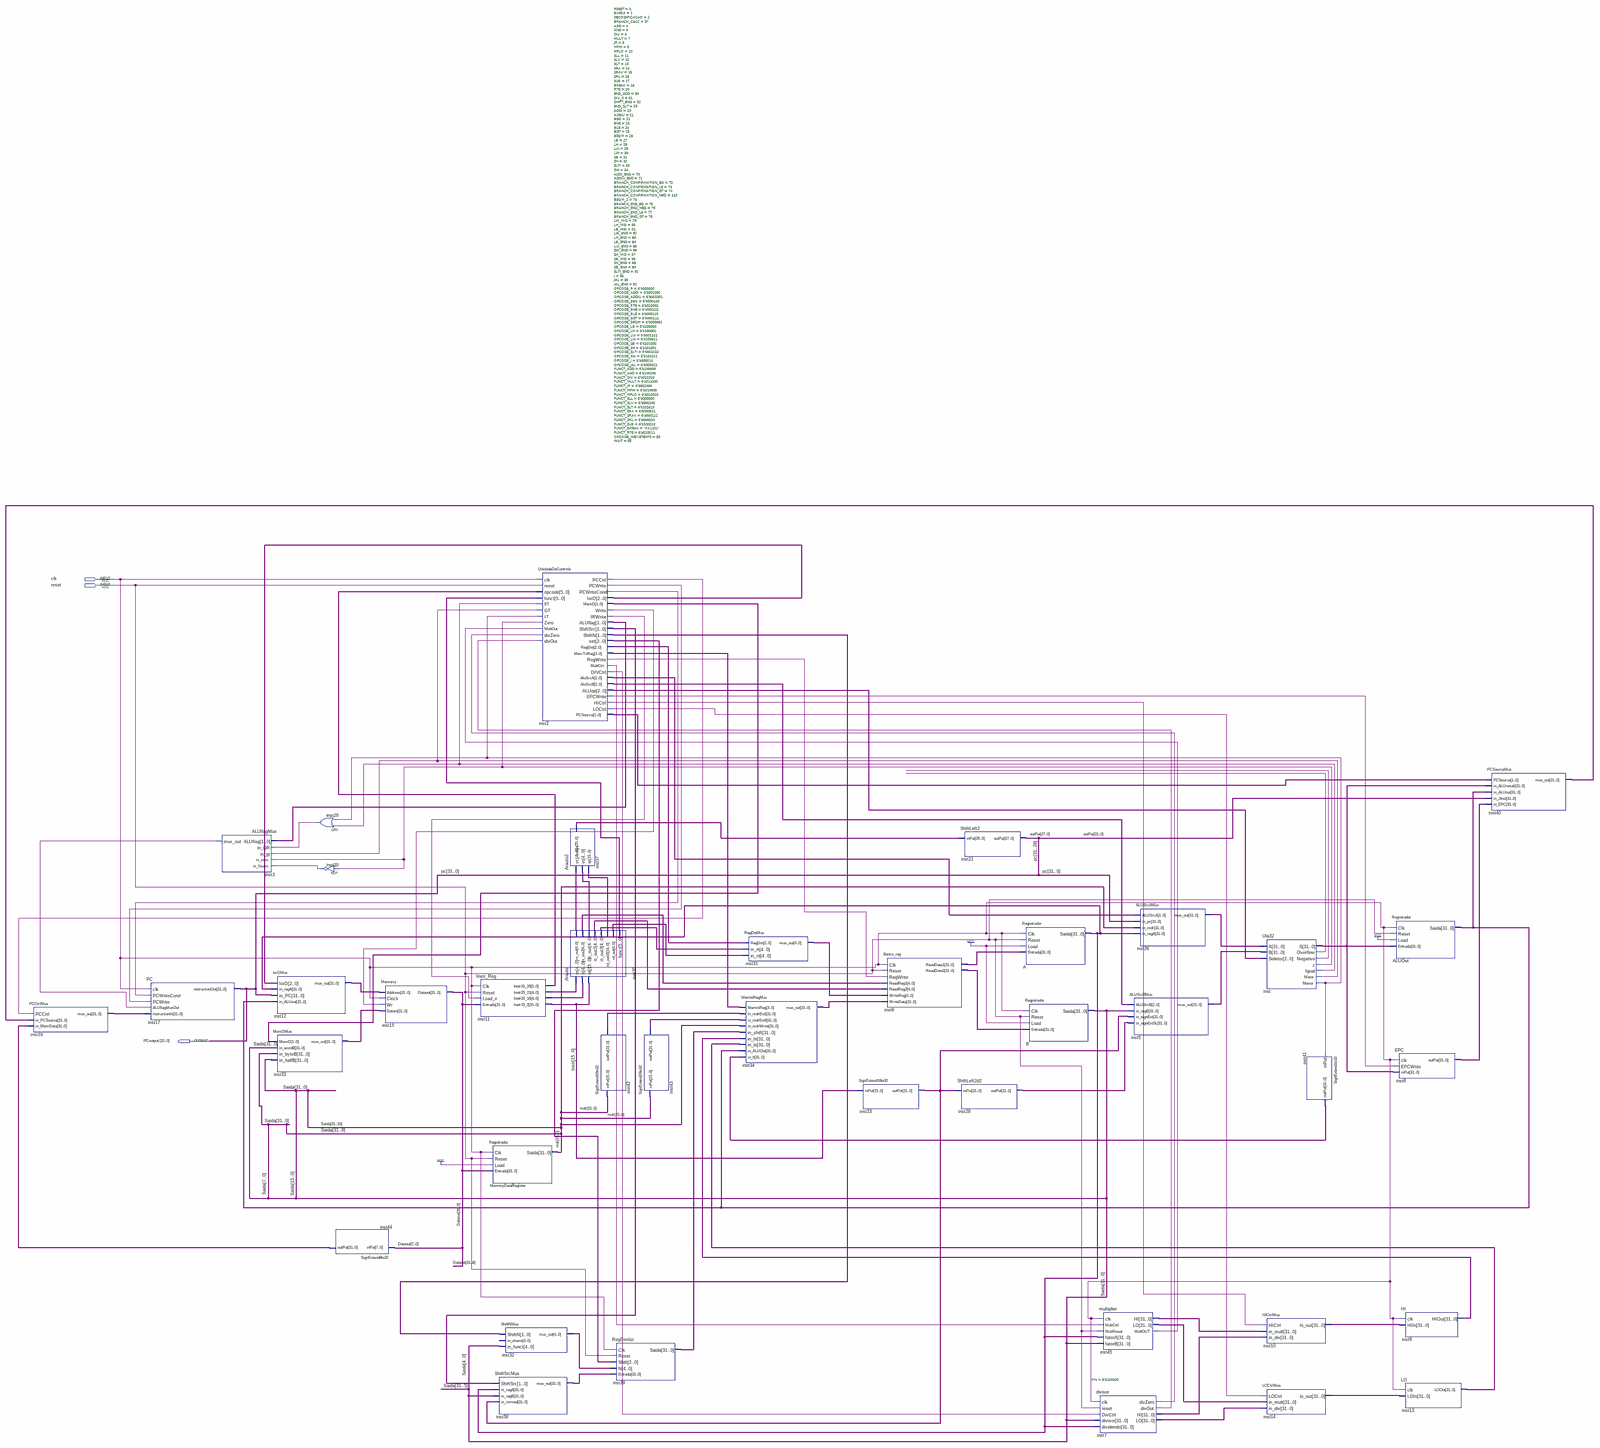
[diagram p0: schematic sheet, whole]
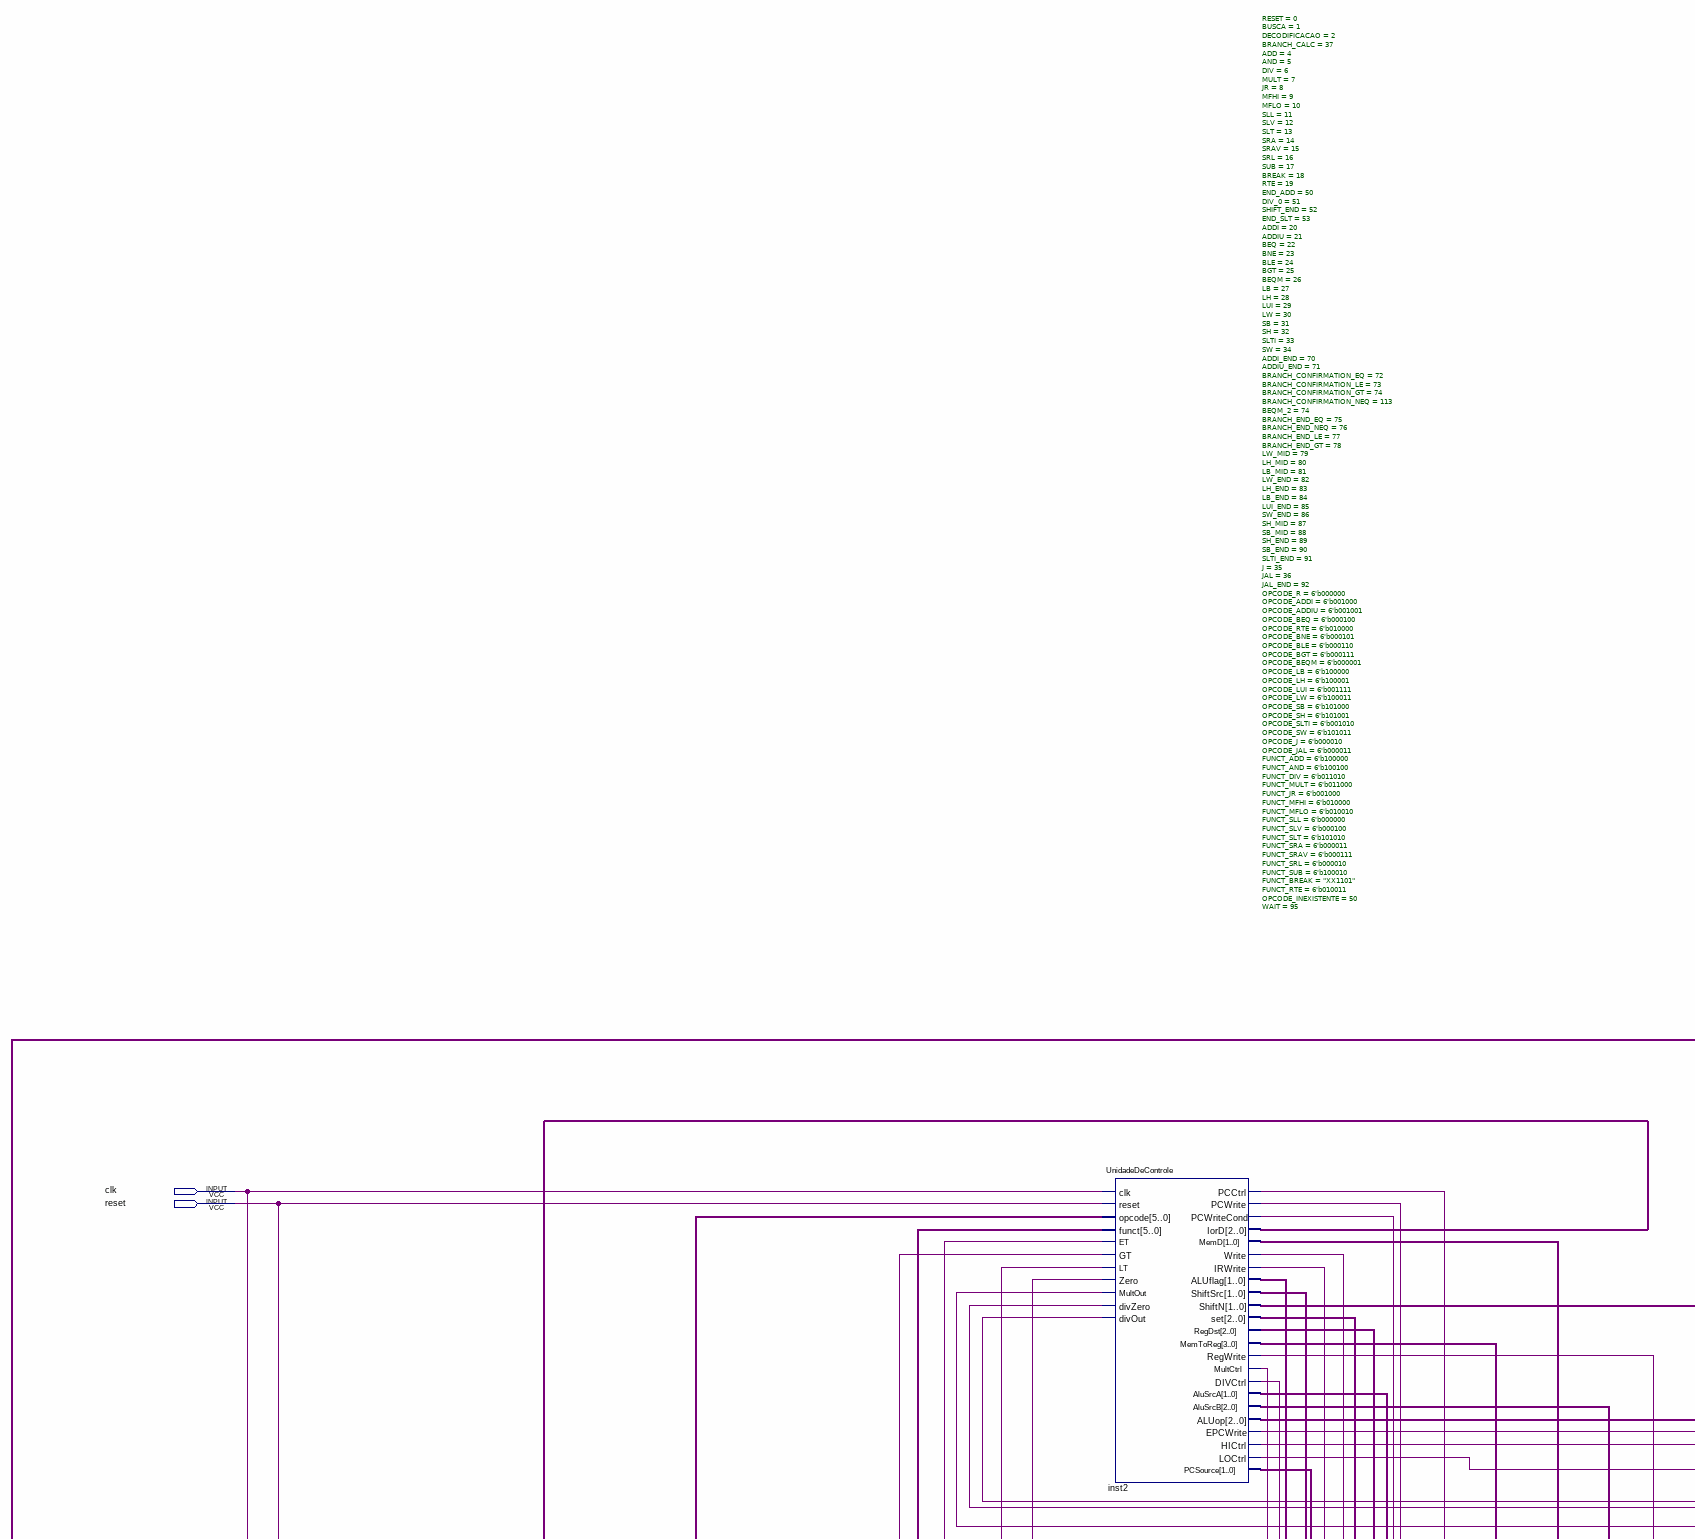
[diagram p1: schematic sheet, upper left part]
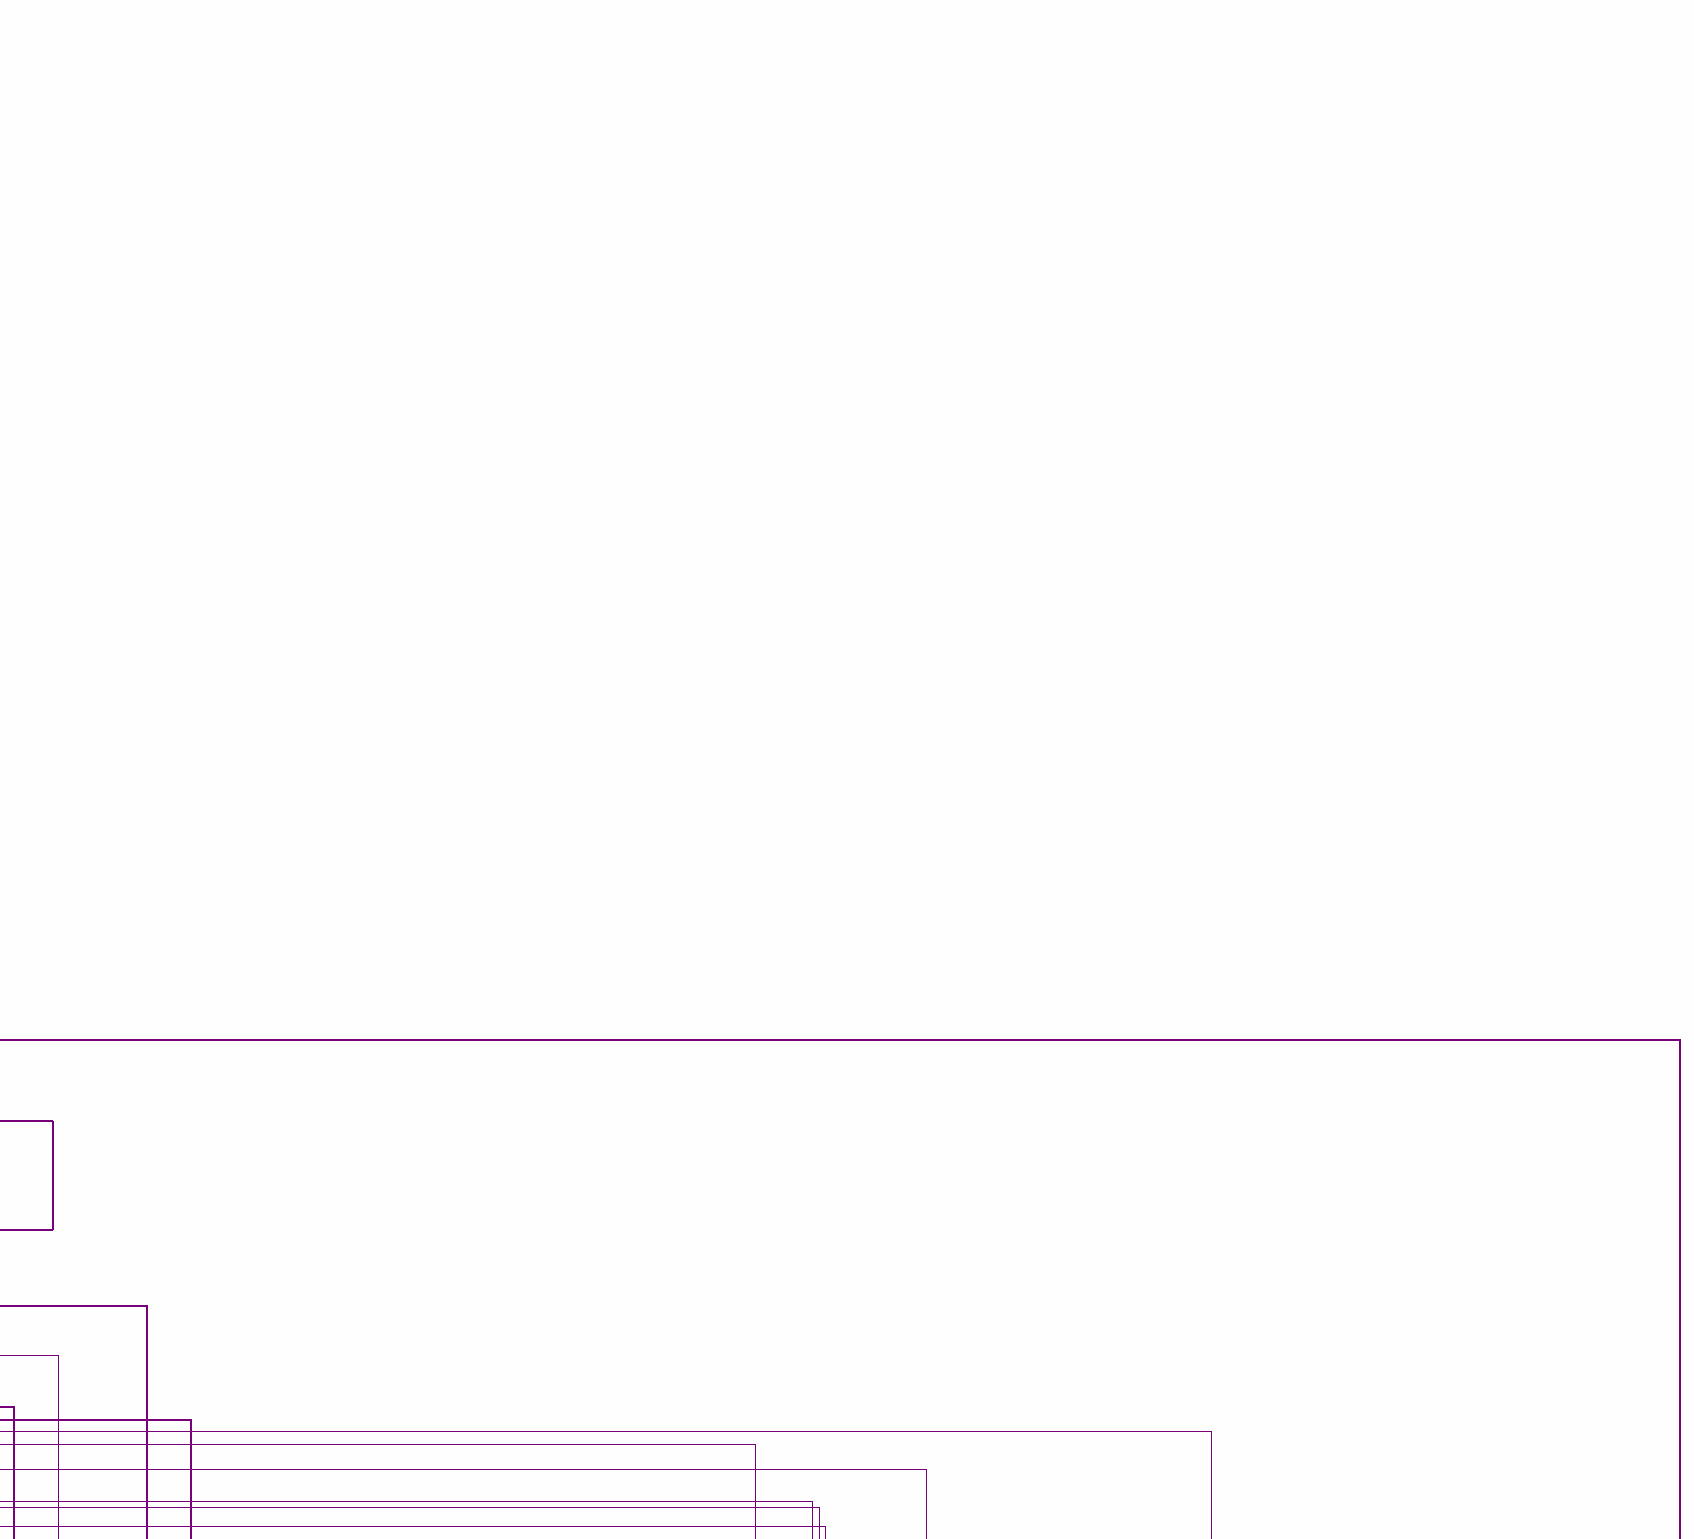
[diagram p2: schematic sheet, upper right part]
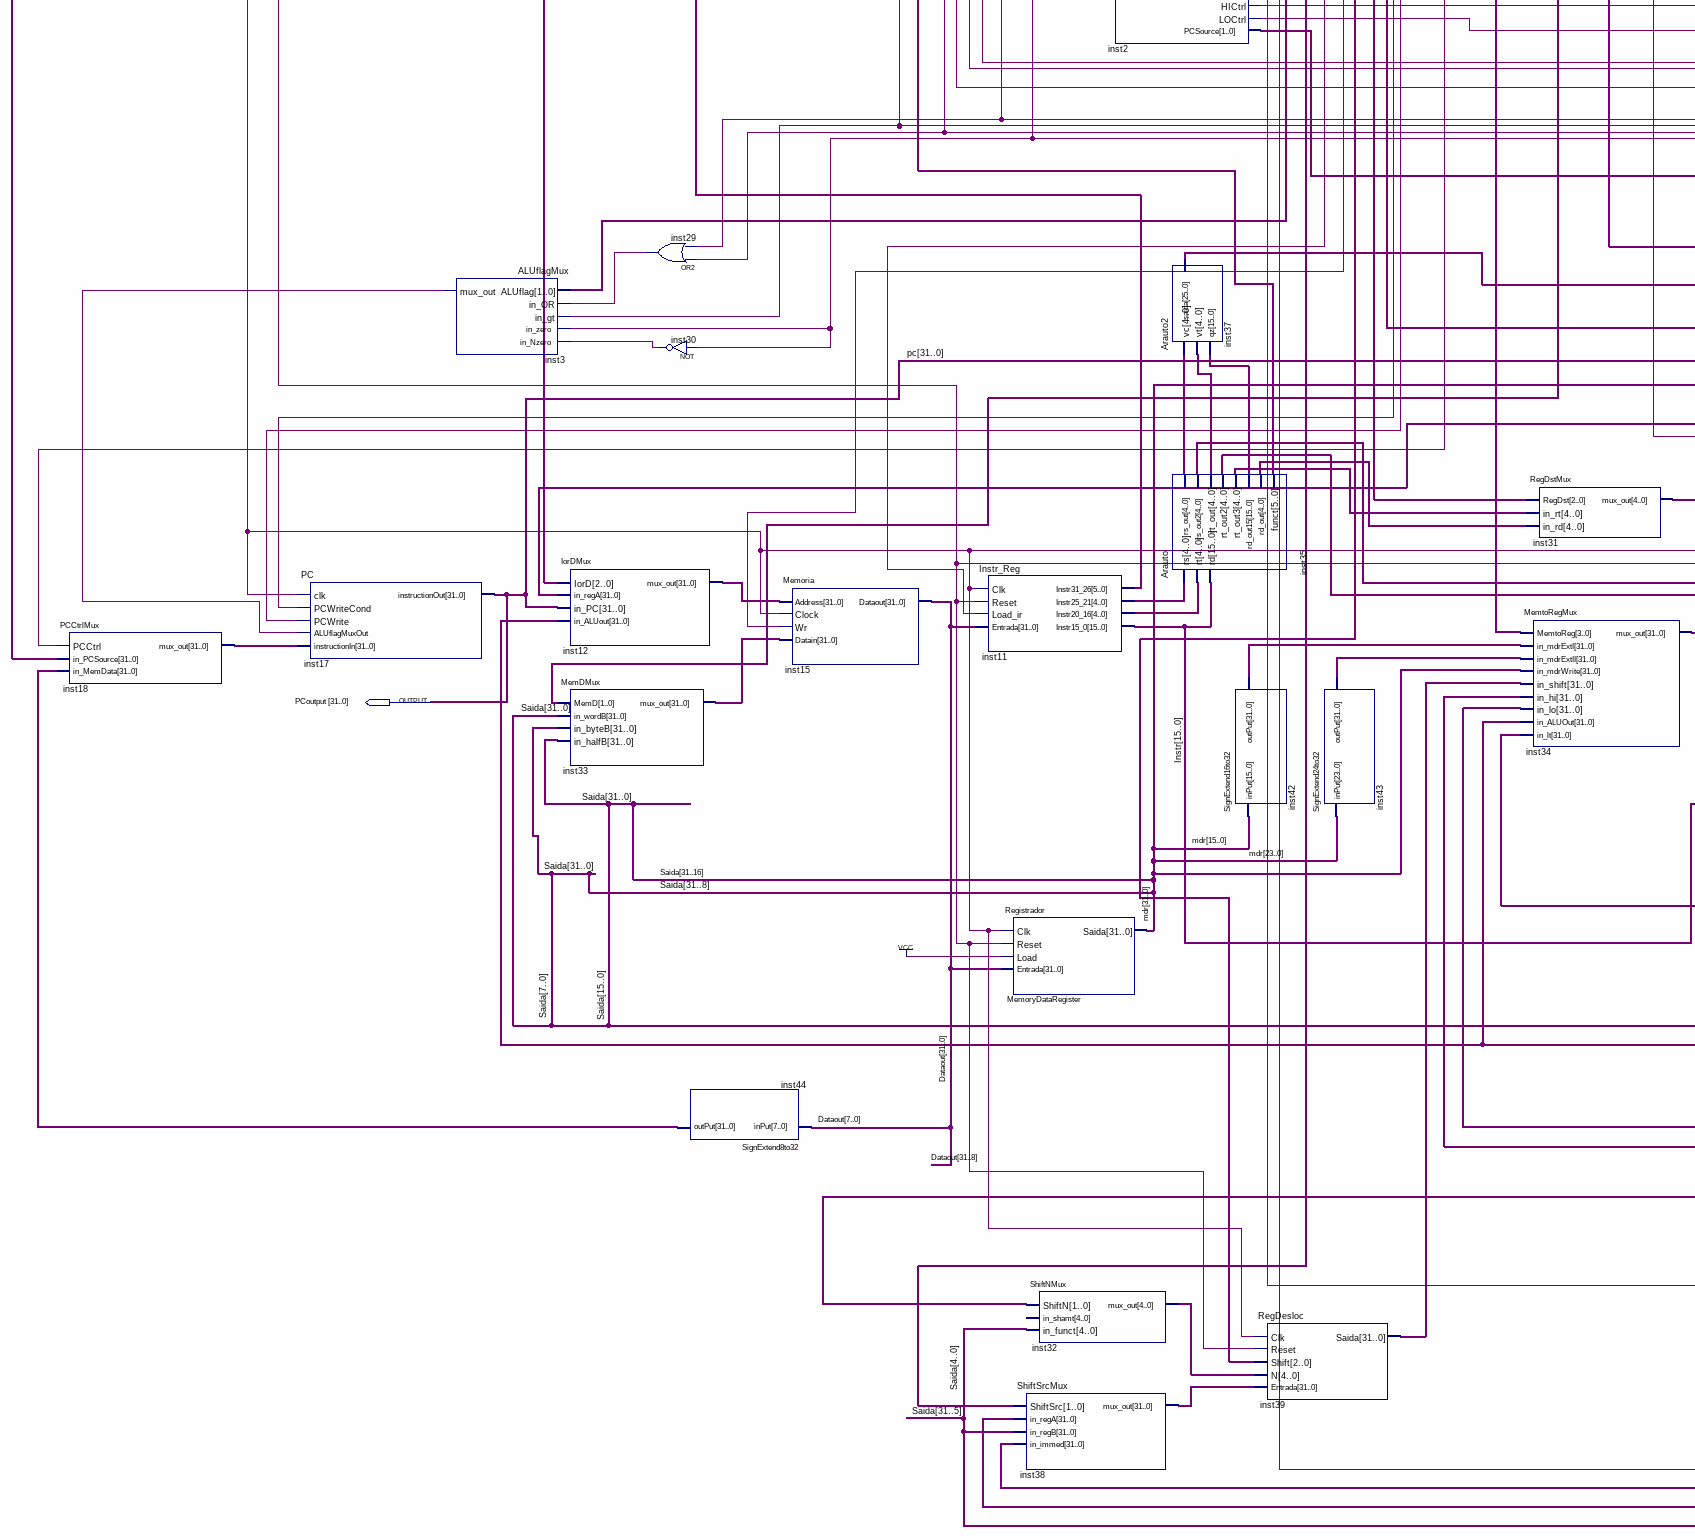
[diagram p3: schematic sheet, lower left part]
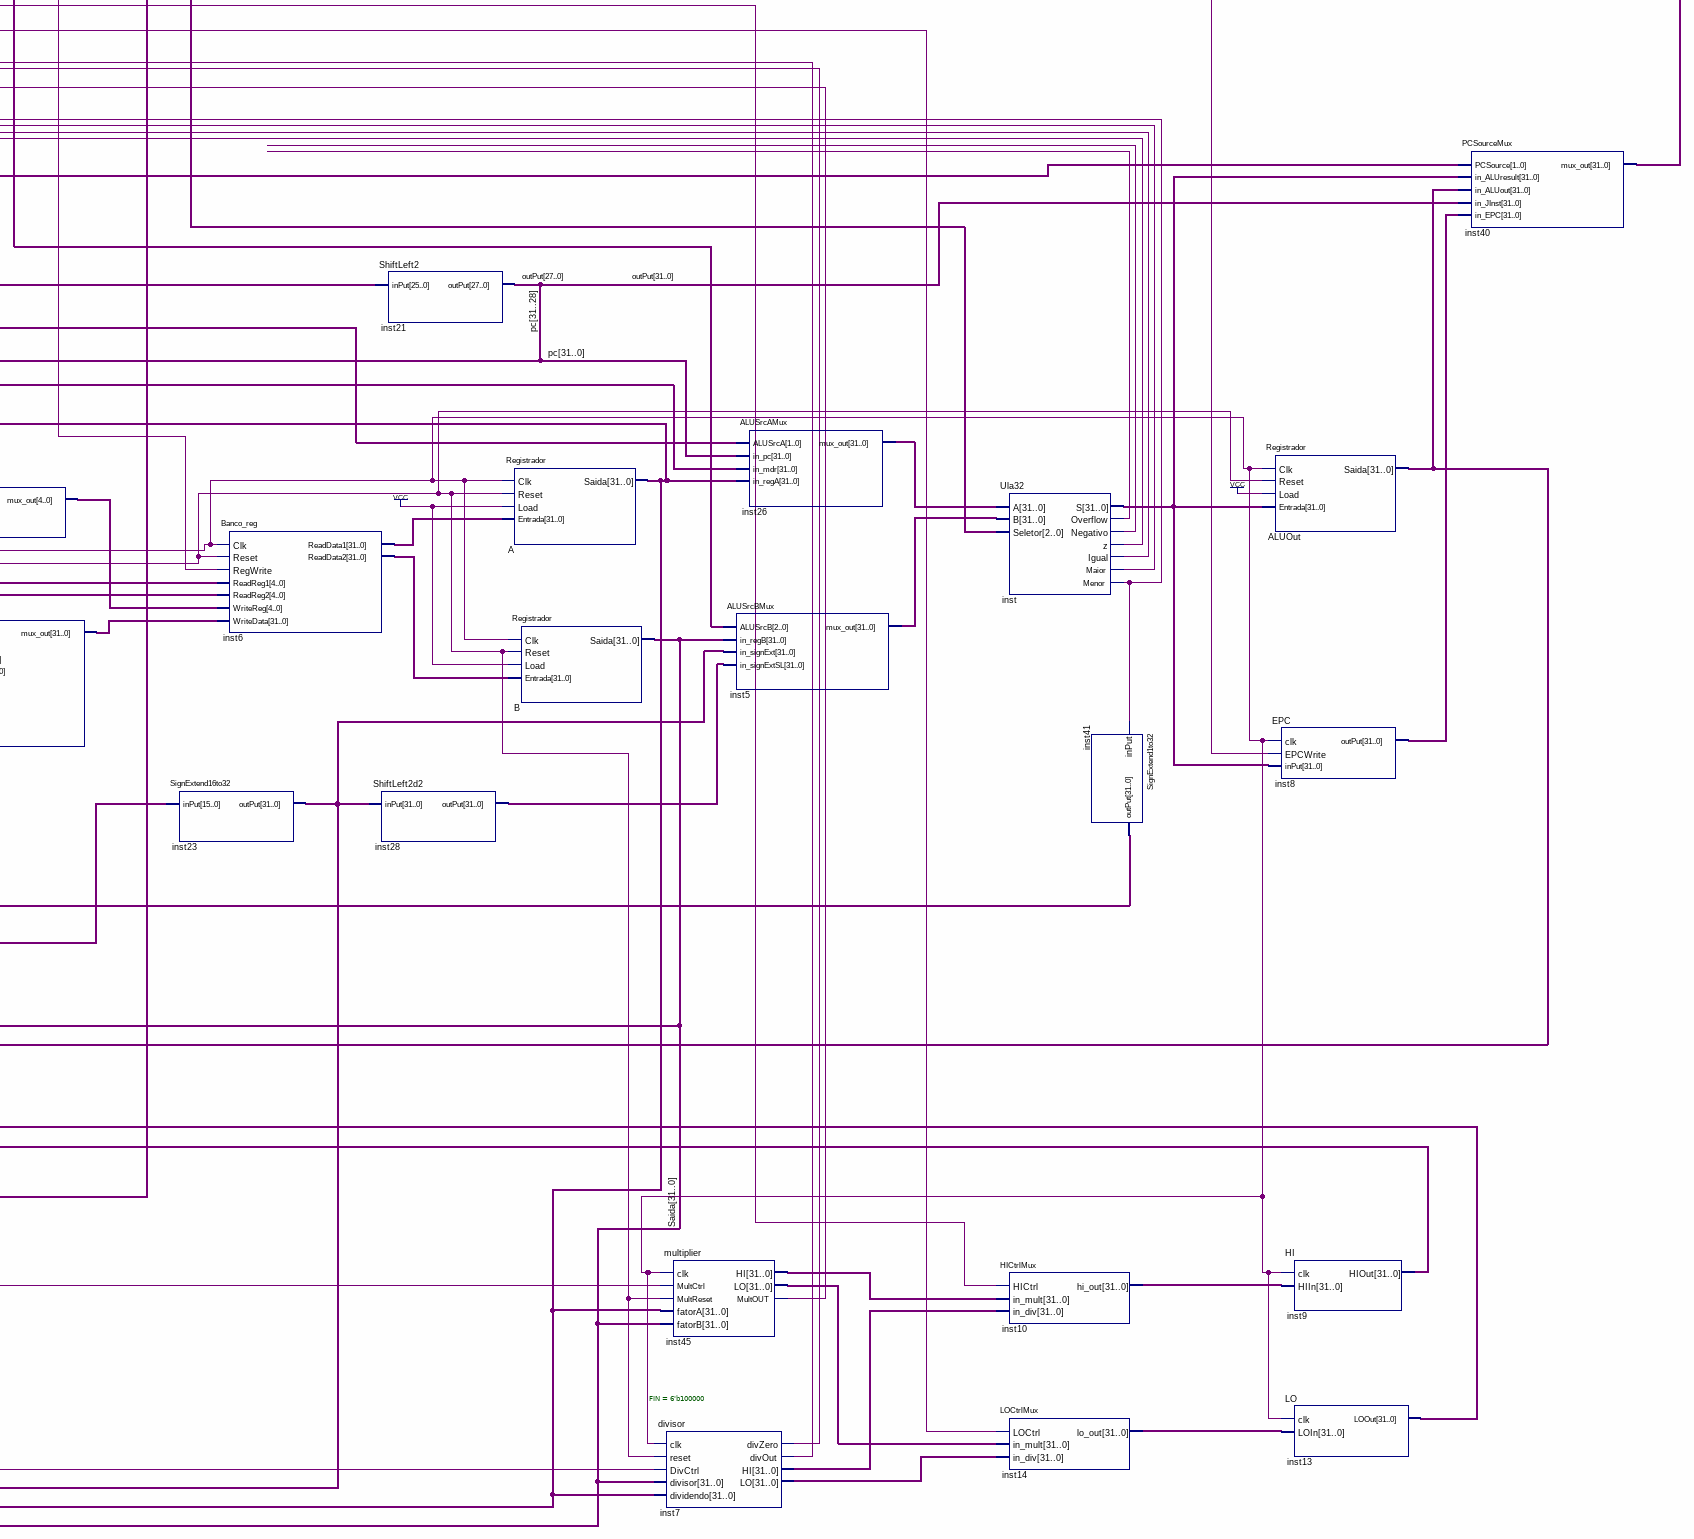
[diagram p4: schematic sheet, lower right part]
// Quartus schematic DiagramaProcessador.bdf as structural Verilog: 40 symbols, 3 pins
module DiagramaProcessador (
  input  clk,
  input  reset,
  output [31:0] PCoutput
);

  wire inst2_divctrl, inst2_epcwrite, inst2_hictrl, inst2_irwrite, inst2_loctrl, inst2_multctrl,
       inst2_pcctrl, inst2_pcwrite, inst2_pcwritecond, inst2_regwrite, inst2_write, inst3_mux_out,
       inst7_divout, inst7_divzero, inst29_out, inst30_out, inst45_multout, inst_igual, inst_maior,
       inst_menor, inst_negativo, inst_overflow, inst_z;
  wire [1:0] inst2_aluflag, inst2_alusrca, inst2_memd, inst2_pcsource, inst2_shiftn, inst2_shiftsrc;
  wire [2:0] inst2_aluop, inst2_alusrcb, inst2_iord, inst2_regdst, inst2_set;
  wire [3:0] inst2_memtoreg;
  wire [4:0] inst11_instr20_16, inst11_instr25_21, inst31_mux_out, inst32_mux_out, inst35_rd_out,
       inst35_rs_out, inst35_rs_out2, inst35_rt_out, inst35_rt_out2, inst35_rt_out3;
  wire [5:0] inst11_instr31_26, inst35_funct;
  wire [15:0] inst35_rd_out15, Instr;
  wire [25:0] inst37_saida;
  wire [31:0] A_saida, ALUOut_saida, Dataout, inst5_mux_out, inst6_readdata1, inst6_readdata2, inst7_hi,
       inst7_lo, inst8_output, inst9_hiout, inst10_hi_out, inst12_mux_out, inst13_loout, inst14_lo_out,
       inst18_mux_out, inst23_output, inst26_mux_out, inst28_output, inst33_mux_out, inst34_mux_out,
       inst38_mux_out, inst39_saida, inst40_mux_out, inst41_output, inst42_output, inst43_output,
       inst44_output, inst45_hi, inst45_lo, inst_s, mdr, outPut, Saida;

  PCCtrlMux inst18 (
    .PCCtrl(inst2_pcctrl), .in_PCSource(inst40_mux_out), .in_MemData(inst44_output), .mux_out(inst18_mux_out));
  PC inst17 (
    .clk(clk), .PCWriteCond(inst2_pcwritecond), .PCWrite(inst2_pcwrite), .ALUflagMuxOut(inst3_mux_out),
    .instructionIn(inst18_mux_out), .instructionOut(PCoutput));
  ALUflagMux inst3 (
    .ALUflag(inst2_aluflag), .in_OR(inst29_out), .in_gt(inst_maior), .in_zero(inst_z), .in_Nzero(inst30_out),
    .mux_out(inst3_mux_out));
  IorDMux inst12 (
    .IorD(inst2_iord), .in_regA(A_saida), .in_PC(PCoutput), .in_ALUout(ALUOut_saida), .mux_out(inst12_mux_out));
  MemDMux inst33 (.MemD(inst2_memd), .in_wordB(Saida), .in_byteB(Saida), .in_halfB(Saida), .mux_out(inst33_mux_out));
  or inst29 (inst29_out, inst_igual, inst_menor);
  not inst30 (inst30_out, inst_z);
  SignExtend8to32 inst44 (.inPut(Dataout[7:0]), .outPut(inst44_output));
  Memoria inst15 (.Address(inst12_mux_out), .Clock(clk), .Wr(inst2_write), .Datain(inst33_mux_out), .Dataout(Dataout));
  Instr_Reg inst11 (
    .Clk(clk), .Reset(reset), .Load_ir(inst2_irwrite), .Entrada(Dataout), .Instr31_26(inst11_instr31_26),
    .Instr25_21(inst11_instr25_21), .Instr20_16(inst11_instr20_16), .Instr15_0(Instr));
  Registrador MemoryDataRegister (.Clk(clk), .Reset(reset), .Load(1'b1), .Entrada(Dataout), .Saida(mdr));
  ShiftNMux inst32 (.ShiftN(inst2_shiftn), .in_funct(Saida[4:0]), .mux_out(inst32_mux_out));  // open: in_shamt
  ShiftSrcMux inst38 (
    .ShiftSrc(inst2_shiftsrc), .in_regA(A_saida), .in_regB(Saida), .in_immed(inst23_output),
    .mux_out(inst38_mux_out));
  UnidadeDeControle #(.RESET(0), .BUSCA(1), .DECODIFICACAO(2), .BRANCH_CALC(37), .ADD(4), .AND(5), .DIV(6), .MULT(7), .JR(8), .MFHI(9), .MFLO(10), .SLL(11), .SLV(12), .SLT(13), .SRA(14), .SRAV(15), .SRL(16), .SUB(17), .BREAK(18), .RTE(19), .END_ADD(50), .DIV_0(51), .SHIFT_END(52), .END_SLT(53), .ADDI(20), .ADDIU(21), .BEQ(22), .BNE(23), .BLE(24), .BGT(25), .BEQM(26), .LB(27), .LH(28), .LUI(29), .LW(30), .SB(31), .SH(32), .SLTI(33), .SW(34), .ADDI_END(70), .ADDIU_END(71), .BRANCH_CONFIRMATION_EQ(72), .BRANCH_CONFIRMATION_LE(73), .BRANCH_CONFIRMATION_GT(74), .BRANCH_CONFIRMATION_NEQ(113), .BEQM_2(74), .BRANCH_END_EQ(75), .BRANCH_END_NEQ(76), .BRANCH_END_LE(77), .BRANCH_END_GT(78), .LW_MID(79), .LH_MID(80), .LB_MID(81), .LW_END(82), .LH_END(83), .LB_END(84), .LUI_END(85), .SW_END(86), .SH_MID(87), .SB_MID(88), .SH_END(89), .SB_END(90), .SLTI_END(91), .J(35), .JAL(36), .JAL_END(92), .OPCODE_R(6'b000000), .OPCODE_ADDI(6'b001000), .OPCODE_ADDIU(6'b001001), .OPCODE_BEQ(6'b000100), .OPCODE_RTE(6'b010000), .OPCODE_BNE(6'b000101), .OPCODE_BLE(6'b000110), .OPCODE_BGT(6'b000111), .OPCODE_BEQM(6'b000001), .OPCODE_LB(6'b100000), .OPCODE_LH(6'b100001), .OPCODE_LUI(6'b001111), .OPCODE_LW(6'b100011), .OPCODE_SB(6'b101000), .OPCODE_SH(6'b101001), .OPCODE_SLTI(6'b001010), .OPCODE_SW(6'b101011), .OPCODE_J(6'b000010), .OPCODE_JAL(6'b000011), .FUNCT_ADD(6'b100000), .FUNCT_AND(6'b100100), .FUNCT_DIV(6'b011010), .FUNCT_MULT(6'b011000), .FUNCT_JR(6'b001000), .FUNCT_MFHI(6'b010000), .FUNCT_MFLO(6'b010010), .FUNCT_SLL(6'b000000), .FUNCT_SLV(6'b000100), .FUNCT_SLT(6'b101010), .FUNCT_SRA(6'b000011), .FUNCT_SRAV(6'b000111), .FUNCT_SRL(6'b000010), .FUNCT_SUB(6'b100010), .FUNCT_BREAK("XX1101"), .FUNCT_RTE(6'b010011), .OPCODE_INEXISTENTE(50), .WAIT(95)) inst2 (
    .clk(clk), .reset(reset), .opcode(inst11_instr31_26), .funct(inst35_funct), .ET(inst_igual),
    .GT(inst_maior), .LT(inst_menor), .Zero(inst_z), .MultOut(inst45_multout), .divZero(inst7_divzero),
    .divOut(inst7_divout), .PCCtrl(inst2_pcctrl), .PCWrite(inst2_pcwrite), .PCWriteCond(inst2_pcwritecond),
    .IorD(inst2_iord), .MemD(inst2_memd), .Write(inst2_write), .IRWrite(inst2_irwrite),
    .ALUflag(inst2_aluflag), .ShiftSrc(inst2_shiftsrc), .ShiftN(inst2_shiftn), .set(inst2_set),
    .RegDst(inst2_regdst), .MemToReg(inst2_memtoreg), .RegWrite(inst2_regwrite), .MultCtrl(inst2_multctrl),
    .DIVCtrl(inst2_divctrl), .AluSrcA(inst2_alusrca), .AluSrcB(inst2_alusrcb), .ALUop(inst2_aluop),
    .EPCWrite(inst2_epcwrite), .HICtrl(inst2_hictrl), .LOCtrl(inst2_loctrl), .PCSource(inst2_pcsource));
  Arauto2 inst37 (.vc(inst35_rs_out), .vt(inst35_rt_out), .qz(inst35_rd_out15), .saida(inst37_saida));
  Arauto inst35 (
    .rs(inst11_instr25_21), .rt(inst11_instr20_16), .rd(Instr), .rs_out(inst35_rs_out),
    .rs_out2(inst35_rs_out2), .rt_out(inst35_rt_out), .rt_out2(inst35_rt_out2), .rt_out3(inst35_rt_out3),
    .rd_out15(inst35_rd_out15), .rd_out(inst35_rd_out), .funct(inst35_funct));
  SignExtend16to32 inst42 (.inPut(mdr[15:0]), .outPut(inst42_output));
  RegDesloc inst39 (
    .Clk(clk), .Reset(reset), .Shift(inst2_set), .N(inst32_mux_out), .Entrada(inst38_mux_out),
    .Saida(inst39_saida));
  SignExtend24to32 inst43 (.inPut(mdr[23:0]), .outPut(inst43_output));
  RegDstMux inst31 (.RegDst(inst2_regdst), .in_rt(inst35_rt_out3), .in_rd(inst35_rd_out), .mux_out(inst31_mux_out));
  MemtoRegMux inst34 (
    .MemtoReg(inst2_memtoreg), .in_mdrExtI(inst42_output), .in_mdrExtII(inst43_output), .in_mdrWrite(mdr),
    .in_shift(inst39_saida), .in_hi(inst9_hiout), .in_lo(inst13_loout), .in_ALUOut(ALUOut_saida),
    .in_lt(inst41_output), .mux_out(inst34_mux_out));
  SignExtend16to32 inst23 (.inPut(Instr), .outPut(inst23_output));
  Banco_reg inst6 (
    .Clk(clk), .Reset(reset), .RegWrite(inst2_regwrite), .ReadReg1(inst35_rs_out2),
    .ReadReg2(inst35_rt_out2), .WriteReg(inst31_mux_out), .WriteData(inst34_mux_out),
    .ReadData1(inst6_readdata1), .ReadData2(inst6_readdata2));
  ShiftLeft2 inst21 (.inPut(inst37_saida), .outPut(outPut[27:0]));
  ShiftLeft2d2 inst28 (.inPut(inst23_output), .outPut(inst28_output));
  Registrador A (.Clk(clk), .Reset(reset), .Load(1'b1), .Entrada(inst6_readdata1), .Saida(A_saida));
  Registrador B (.Clk(clk), .Reset(reset), .Load(1'b1), .Entrada(inst6_readdata2), .Saida(Saida));
  multiplier inst45 (
    .clk(clk), .MultCtrl(inst2_multctrl), .MultReset(reset), .fatorA(A_saida), .fatorB(Saida),
    .HI(inst45_hi), .LO(inst45_lo), .MultOUT(inst45_multout));
  divisor #(.FIN(6'b100000)) inst7 (
    .clk(clk), .reset(reset), .DivCtrl(inst2_divctrl), .divisor(Saida), .dividendo(A_saida),
    .divZero(inst7_divzero), .divOut(inst7_divout), .HI(inst7_hi), .LO(inst7_lo));
  ALUSrcAMux inst26 (
    .ALUSrcA(inst2_alusrca), .in_pc(PCoutput), .in_mdr(mdr), .in_regA(A_saida), .mux_out(inst26_mux_out));
  ALUSrcBMux inst5 (
    .ALUSrcB(inst2_alusrcb), .in_regB(Saida), .in_signExt(inst23_output), .in_signExtSL(inst28_output),
    .mux_out(inst5_mux_out));
  Ula32 inst (
    .A(inst26_mux_out), .B(inst5_mux_out), .Seletor(inst2_aluop), .S(inst_s), .Overflow(inst_overflow),
    .Negativo(inst_negativo), .z(inst_z), .Igual(inst_igual), .Maior(inst_maior), .Menor(inst_menor));
  HICtrlMux inst10 (.HICtrl(inst2_hictrl), .in_mult(inst45_hi), .in_div(inst7_hi), .hi_out(inst10_hi_out));
  LOCtrlMux inst14 (.LOCtrl(inst2_loctrl), .in_mult(inst45_lo), .in_div(inst7_lo), .lo_out(inst14_lo_out));
  SignExtend1to32 inst41 (.inPut(inst_menor), .outPut(inst41_output));
  Registrador ALUOut (.Clk(clk), .Reset(reset), .Load(1'b1), .Entrada(inst_s), .Saida(ALUOut_saida));
  EPC inst8 (.clk(clk), .EPCWrite(inst2_epcwrite), .inPut(inst_s), .outPut(inst8_output));
  HI inst9 (.clk(clk), .HIIn(inst10_hi_out), .HIOut(inst9_hiout));
  LO inst13 (.clk(clk), .LOIn(inst14_lo_out), .LOOut(inst13_loout));
  PCSourceMux inst40 (
    .PCSource(inst2_pcsource), .in_ALUresult(inst_s), .in_ALUout(ALUOut_saida), .in_JInst(outPut),
    .in_EPC(inst8_output), .mux_out(inst40_mux_out));

  // Other names for the same wires on the sheet: pc[31:0] = PCoutput
endmodule
